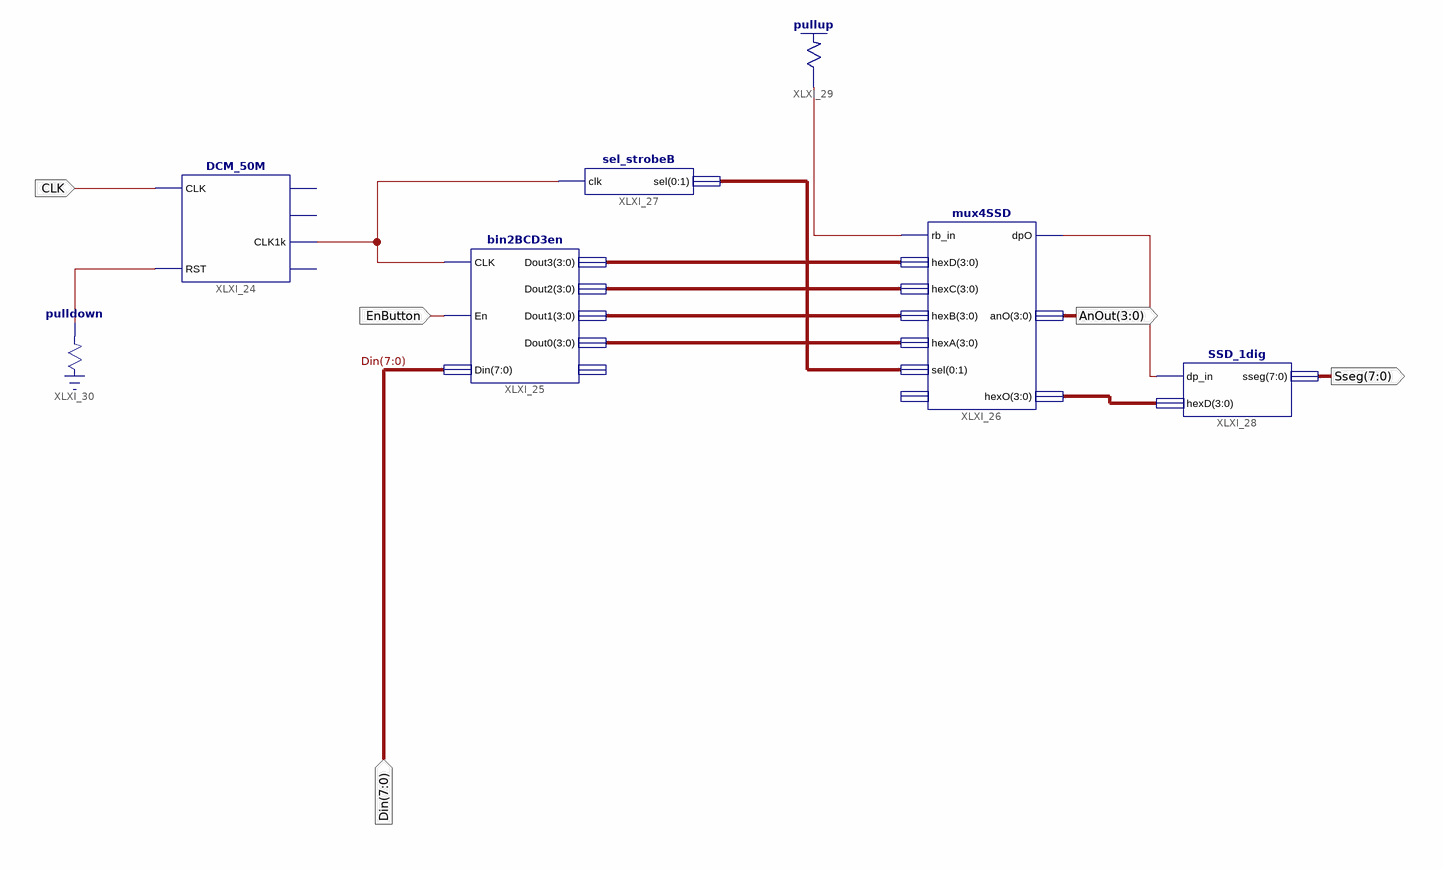
[diagram p0: schematic sheet 1]
// Xilinx ISE schematic Exp3.sch (spartan3e) as structural Verilog: 7 symbols, 5 ports
module Exp3 (
  input  CLK,
  input  [7:0] Din,
  input  EnButton,
  output [3:0] AnOut,
  output [7:0] Sseg
);

  wire XLXN_14, XLXN_15, XLXN_26, XLXN_27;
  wire [1:0] XLXN_28;
  wire [3:0] XLXN_20, XLXN_21, XLXN_22, XLXN_23, XLXN_30;

  DCM_50M XLXI_24 (.CLK(CLK), .RST(XLXN_26), .CLK1k(XLXN_27));  // open: CLK1M, CLK10k, CLK1
  bin2BCD3en XLXI_25 (
    .CLK(XLXN_27), .En(EnButton), .Din(Din), .Dout3(XLXN_23), .Dout2(XLXN_22), .Dout1(XLXN_21),
    .Dout0(XLXN_20));  // open: RBout
  mux4SSD XLXI_26 (
    .rb_in(XLXN_14), .hexD(XLXN_23), .hexC(XLXN_22), .hexB(XLXN_21), .hexA(XLXN_20),
    .sel({XLXN_28[0], XLXN_28[1]}), .dpO(XLXN_15), .anO(AnOut), .hexO(XLXN_30));  // open: dp_in
  sel_strobeB XLXI_27 (.clk(XLXN_27), .sel({XLXN_28[0], XLXN_28[1]}));
  SSD_1dig XLXI_28 (.dp_in(XLXN_15), .hexD(XLXN_30), .sseg(Sseg));
  \pullup  XLXI_29 (.O(XLXN_14));
  \pulldown  XLXI_30 (.O(XLXN_26));
endmodule
